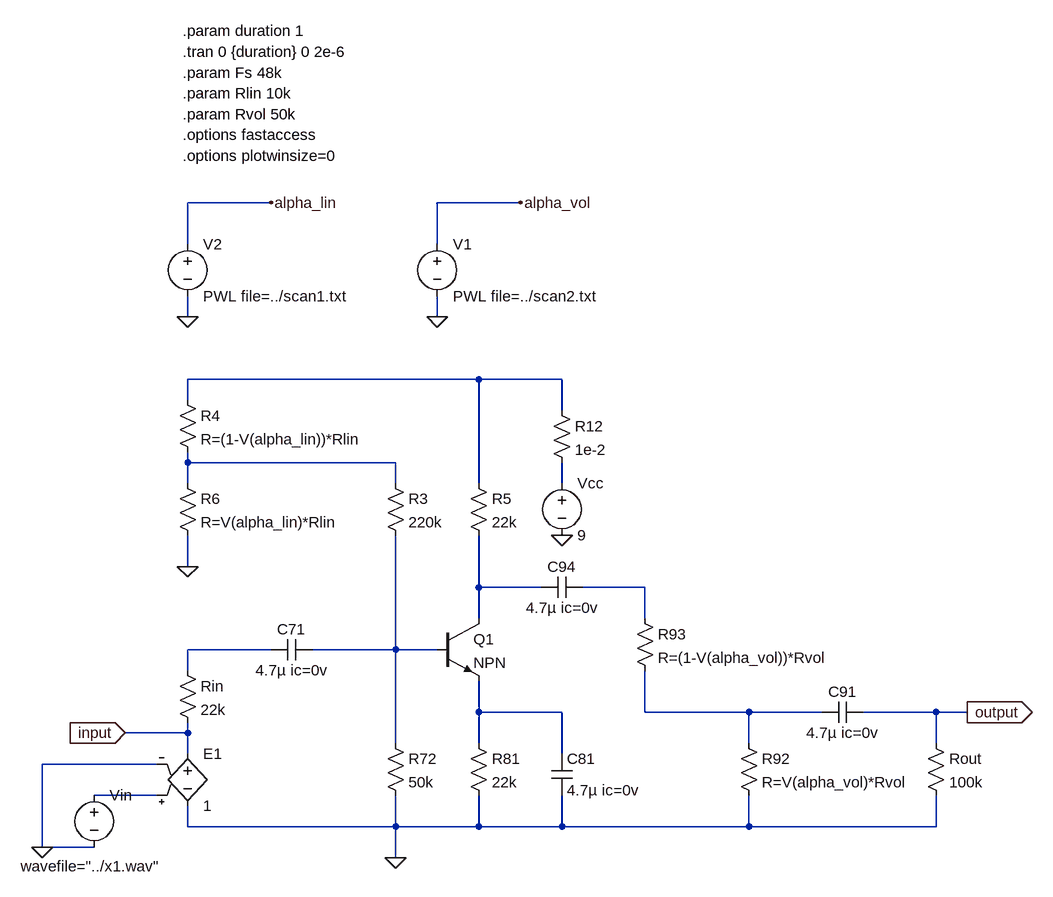
[diagram p0: schematic Fuzz Static.asc]
Fuzz Static.asc, the LTspice schematic file:
Version 4
SHEET 1 3724 884
WIRE 832 -1056 704 -1056
WIRE 1216 -1056 1088 -1056
WIRE 704 -992 704 -1056
WIRE 1088 -992 1088 -1056
WIRE 704 -880 704 -912
WIRE 1088 -880 1088 -912
WIRE 1152 -784 704 -784
WIRE 1280 -784 1152 -784
WIRE 704 -752 704 -784
WIRE 1280 -736 1280 -784
WIRE 704 -656 704 -672
WIRE 1024 -656 704 -656
WIRE 704 -624 704 -656
WIRE 1024 -624 1024 -656
WIRE 1152 -624 1152 -784
WIRE 1280 -624 1280 -656
WIRE 704 -496 704 -544
WIRE 1152 -464 1152 -544
WIRE 1248 -464 1152 -464
WIRE 1408 -464 1312 -464
WIRE 1152 -416 1152 -464
WIRE 1408 -416 1408 -464
WIRE 832 -368 704 -368
WIRE 1024 -368 1024 -544
WIRE 1024 -368 896 -368
WIRE 1088 -368 1024 -368
WIRE 704 -336 704 -368
WIRE 1152 -272 1152 -320
WIRE 1280 -272 1152 -272
WIRE 1408 -272 1408 -336
WIRE 1568 -272 1408 -272
WIRE 1680 -272 1568 -272
WIRE 1856 -272 1744 -272
WIRE 1904 -272 1856 -272
WIRE 704 -240 704 -256
WIRE 704 -240 608 -240
WIRE 1024 -224 1024 -368
WIRE 1152 -224 1152 -272
WIRE 1568 -224 1568 -272
WIRE 1856 -224 1856 -272
WIRE 704 -208 704 -240
WIRE 1280 -208 1280 -272
WIRE 656 -192 480 -192
WIRE 656 -144 560 -144
WIRE 704 -96 704 -128
WIRE 1024 -96 1024 -144
WIRE 1024 -96 704 -96
WIRE 1152 -96 1152 -144
WIRE 1152 -96 1024 -96
WIRE 1280 -96 1280 -144
WIRE 1280 -96 1152 -96
WIRE 1568 -96 1568 -144
WIRE 1568 -96 1280 -96
WIRE 1856 -96 1856 -144
WIRE 1856 -96 1568 -96
WIRE 480 -64 480 -192
WIRE 560 -64 480 -64
WIRE 1024 -48 1024 -96
FLAG 1280 -544 0
FLAG 1024 -48 0
FLAG 704 -496 0
FLAG 704 -880 0
FLAG 832 -1056 alpha_lin
FLAG 608 -240 input
IOPIN 608 -240 In
FLAG 1088 -880 0
FLAG 1216 -1056 alpha_vol
FLAG 1904 -272 output
IOPIN 1904 -272 Out
FLAG 480 -64 0
SYMBOL res 1136 -640 R0
SYMATTR InstName R5
SYMATTR Value 22k
SYMBOL res 1008 -640 R0
SYMATTR InstName R3
SYMATTR Value 220k
SYMBOL voltage 1280 -640 R0
WINDOW 123 0 0 Left 0
WINDOW 39 0 0 Left 0
SYMATTR InstName Vcc
SYMATTR Value 9
SYMBOL res 1136 -240 R0
SYMATTR InstName R81
SYMATTR Value 22k
SYMBOL res 1552 -240 R0
SYMATTR InstName R92
SYMATTR Value R=V(alpha_vol)*Rvol
SYMBOL res 1008 -240 R0
SYMATTR InstName R72
SYMATTR Value 50k
SYMBOL voltage 560 -160 R0
WINDOW 3 -113 125 Left 2
WINDOW 123 0 0 Left 0
WINDOW 39 0 0 Left 0
SYMATTR Value wavefile="../x1.wav"
SYMATTR InstName Vin
SYMBOL res 1840 -240 R0
SYMATTR InstName Rout
SYMATTR Value 100k
SYMBOL res 1392 -432 R0
SYMATTR InstName R93
SYMATTR Value R=(1-V(alpha_vol))*Rvol
SYMBOL res 688 -768 R0
SYMATTR InstName R4
SYMATTR Value R=(1-V(alpha_lin))*Rlin
SYMBOL res 688 -640 R0
SYMATTR InstName R6
SYMATTR Value R=V(alpha_lin)*Rlin
SYMBOL voltage 704 -1008 R0
WINDOW 123 0 0 Left 0
WINDOW 39 0 0 Left 0
SYMATTR InstName V2
SYMATTR Value PWL file=../scan1.txt
SYMBOL res 688 -352 R0
SYMATTR InstName Rin
SYMATTR Value 22k
SYMBOL res 1264 -752 R0
SYMATTR InstName R12
SYMATTR Value 1e-2
SYMBOL voltage 1088 -1008 R0
WINDOW 123 0 0 Left 0
WINDOW 39 0 0 Left 0
SYMATTR InstName V1
SYMATTR Value PWL file=../scan2.txt
SYMBOL npn 1088 -416 R0
SYMATTR InstName Q1
SYMBOL cap 1312 -480 R90
WINDOW 0 0 32 VBottom 2
WINDOW 3 32 32 VTop 2
SYMATTR InstName C94
SYMATTR Value 4.7µ ic=0v
SYMBOL e2 704 -224 R0
SYMATTR InstName E1
SYMATTR Value 1
SYMBOL cap 1744 -288 R90
WINDOW 0 0 32 VBottom 2
WINDOW 3 32 32 VTop 2
SYMATTR InstName C91
SYMATTR Value 4.7µ ic=0v
SYMBOL cap 1264 -208 R0
SYMATTR InstName C81
SYMATTR Value 4.7µ ic=0v
SYMBOL cap 896 -384 R90
WINDOW 0 0 32 VBottom 2
WINDOW 3 32 32 VTop 2
SYMATTR InstName C71
SYMATTR Value 4.7µ ic=0v
TEXT 696 -1288 Left 2 !.tran 0 {duration} 0 2e-6
TEXT 696 -1224 Left 2 !.param Rlin 10k
TEXT 696 -1192 Left 2 !.param Rvol 50k
TEXT 696 -1160 Left 2 !.options fastaccess
TEXT 696 -1128 Left 2 !.options plotwinsize=0
TEXT 696 -1256 Left 2 !.param Fs 48k
TEXT 696 -1320 Left 2 !.param duration 1

The netlist it stands for:
* Fuzz Static.asc
R5 N001 N004 22k
R3 N002 N007 220k
Vcc N003 0 9
R81 N008 0 22k
R92 N009 0 R=V(alpha_vol)*Rvol
R72 N007 0 50k
Vin N010 0 wavefile="../x1.wav"
Rout output 0 100k
R93 N005 N009 R=(1-V(alpha_vol))*Rvol
R4 N001 N002 R=(1-V(alpha_lin))*Rlin
R6 N002 0 R=V(alpha_lin)*Rlin
V2 alpha_lin 0 PWL file=../scan1.txt
Rin N006 input 22k
R12 N001 N003 1e-2
V1 alpha_vol 0 PWL file=../scan2.txt
Q1 N004 N007 N008 0 NPN
C94 N005 N004 4.7µ ic=0v
E1 input 0 N010 0 1
C91 output N009 4.7µ ic=0v
C81 N008 0 4.7µ ic=0v
C71 N007 N006 4.7µ ic=0v
.model NPN NPN
.model PNP PNP
.lib standard.bjt
.tran 0 {duration} 0 2e-6
.param Rlin 10k
.param Rvol 50k
.options fastaccess
.options plotwinsize=0
.param Fs 48k
.param duration 1
.backanno
.end